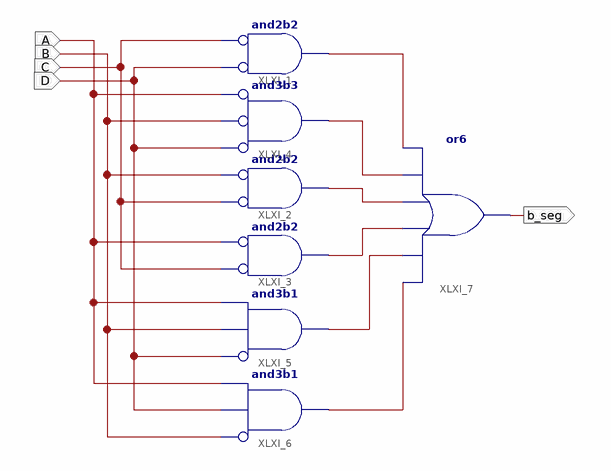
[diagram p0: schematic sheet 1]
// Xilinx ISE schematic bcd4to7b.sch (spartan6) as structural Verilog: 7 symbols, 5 ports
module bcd4to7b (
  input  A,
  input  B,
  input  C,
  input  D,
  output b_seg
);

  wire XLXN_1, XLXN_2, XLXN_3, XLXN_4, XLXN_5, XLXN_6;

  and XLXI_1 (XLXN_1, ~D, ~C);  // and2b2
  and XLXI_2 (XLXN_3, ~C, ~B);  // and2b2
  and XLXI_3 (XLXN_4, ~C, ~A);  // and2b2
  and XLXI_4 (XLXN_2, ~D, ~B, ~A);  // and3b3
  and XLXI_5 (XLXN_5, ~D, B, A);  // and3b1
  and XLXI_6 (XLXN_6, ~B, D, A);  // and3b1
  or XLXI_7 (b_seg, XLXN_6, XLXN_5, XLXN_4, XLXN_3, XLXN_2, XLXN_1);
endmodule
